# EAGLE design scoutshield_v1 (EAGLE 6.5.0)
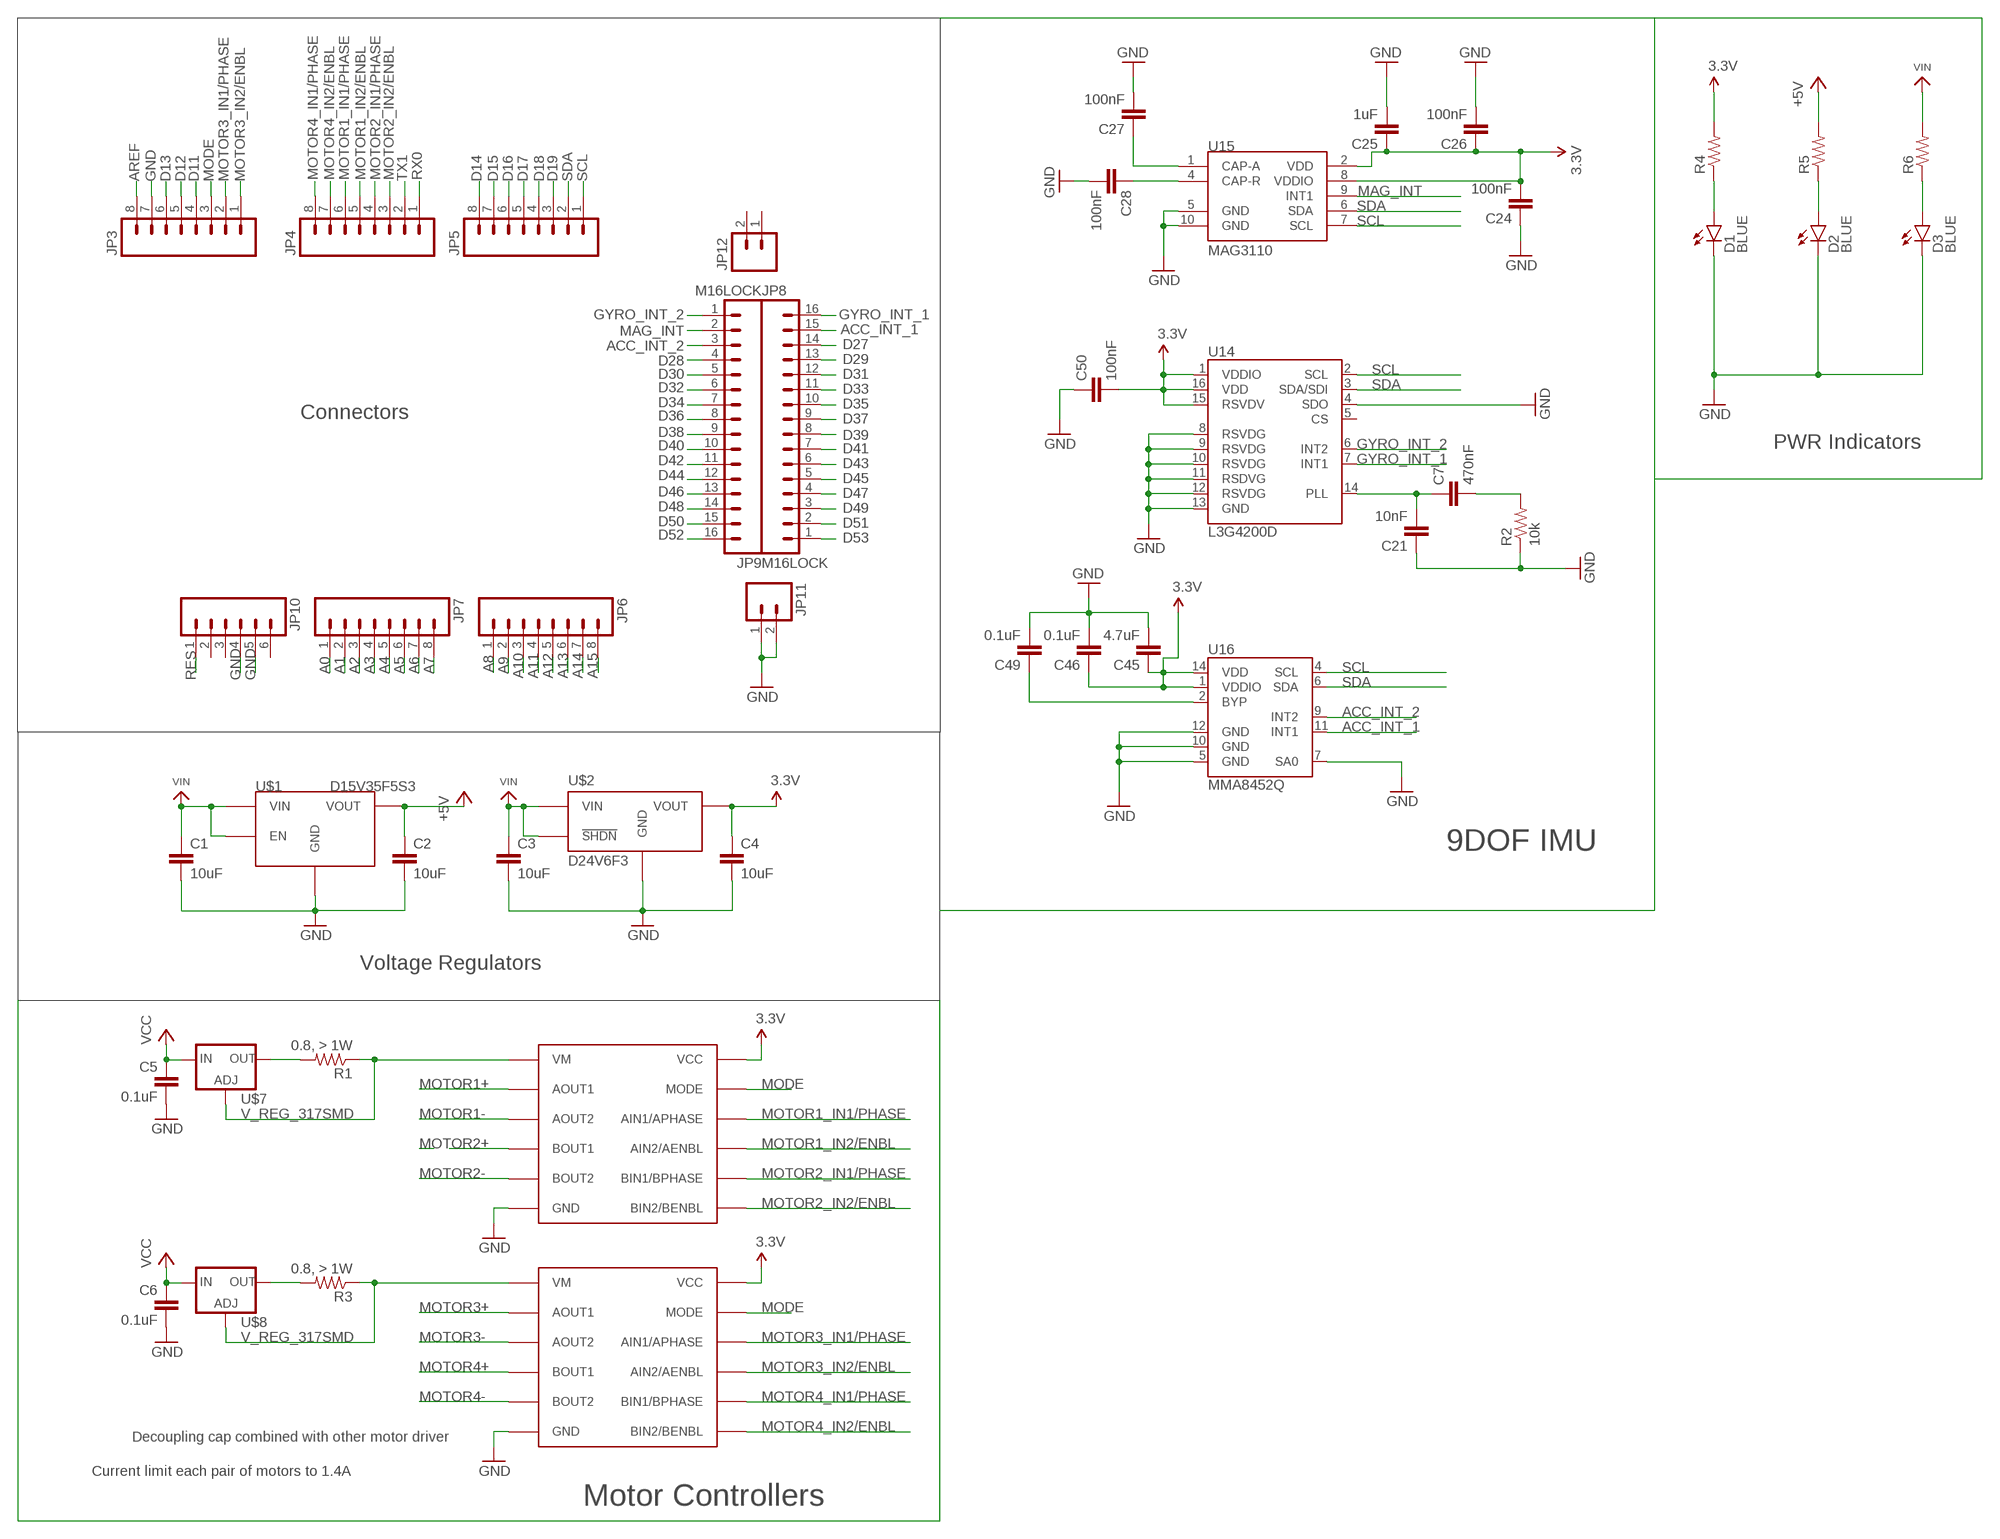
[diagram p0: schematic, sheet 1]

## Parts
C1  10uF  CAP1206  [1206]
C2  10uF  CAP1206  [1206]
C3  10uF  CAP1206  [1206]
C4  10uF  CAP1206  [1206]
C5  0.1uF  CAP0603-CAP  [0603-CAP]
C6  0.1uF  CAP0603-CAP  [0603-CAP]
C7  470nF  CAP0603-CAP  [0603-CAP]
C21  10nF  CAP0603-CAP  [0603-CAP]
C24  100nF  CAP0603-CAP  [0603-CAP]
C25  1uF  CAP0603-CAP  [0603-CAP]
C26  100nF  CAP0603-CAP  [0603-CAP]
C27  100nF  CAP0603-CAP  [0603-CAP]
C28  100nF  CAP0603-CAP  [0603-CAP]
C45  4.7uF  CAP0603-CAP  [0603-CAP]
C46  0.1uF  CAP0603-CAP  [0603-CAP]
C49  0.1uF  CAP0603-CAP  [0603-CAP]
C50  100nF  CAP0603-CAP  [0603-CAP]
D1  BLUE  LED-BLUE0603  [LED-0603]
D2  BLUE  LED-BLUE0603  [LED-0603]
D3  BLUE  LED-BLUE0603  [LED-0603]
JP3  M08LOCK  [1X08_LOCK]
JP4  M08LOCK  [1X08_LOCK]
JP5  M08LOCK  [1X08_LOCK]
JP6  M08LOCK  [1X08_LOCK]
JP7  M08LOCK  [1X08_LOCK]
JP8  M16LOCK  [1X16_LOCK]
JP9  M16LOCK  [1X16_LOCK]
JP10  M06LOCK  [1X06_LOCK]
JP11  M02LOCK  [1X02_LOCK]
JP12  M02LOCK  [1X02_LOCK]
R1  0.8, > 1W  R-US_R2512  [R2512]
R2  10k  R-US_R0603  [R0603]
R3  0.8, > 1W  R-US_R2512  [R2512]
R4  RESISTOR0603-RES  [0603-RES]
R5  RESISTOR0603-RES  [0603-RES]
R6  RESISTOR0603-RES  [0603-RES]
U14  L3G4200D  [LGA16-4X4]
U15  MAG3110  [DFN-10]
U16  MMA8452Q  [QFN-16_0.5MM]
U$1  D15V35F5S3  [D15V35F5S3]
U$2  D24V6F3  [D24V6F3]
U$5  DRV8835  [WSON-12]
U$6  DRV8835  [WSON-12]
U$7  V_REG_317SMD  [SOT223]
U$8  V_REG_317SMD  [SOT223]

## Nets
3.3V: C4.1 C24.2 C25.1 C26.1 C45.1 C46.1 C50.2 R4.2 U14.1(VDDIO) U14.15(RSVDV) U14.16(VDD) U15.2(VDD) U15.8(VDDIO) U16.1(VDDIO) U16.14(VDD) U$2.VOUT U$5.P12(VCC) U$6.P12(VCC)
+5V: C2.1 R5.2 U$1.VOUT
A0: JP7.1
A1: JP7.2
A2: JP7.3
A3: JP7.4
A4: JP7.5
A5: JP7.6
A6: JP7.7
A7: JP7.8
A8: JP6.1
A9: JP6.2
A10: JP6.3
A11: JP6.4
A12: JP6.5
A13: JP6.6
A14: JP6.7
A15: JP6.8
ACC_INT_1: JP8.15 U16.11(INT1)
ACC_INT_2: JP9.3 U16.9(INT2)
AREF: JP3.8
D11: JP3.4
D12: JP3.5
D13: JP3.6
D14: JP5.8
D15: JP5.7
D16: JP5.6
D17: JP5.5
D18: JP5.4
D19: JP5.3
D27: JP8.14
D28: JP9.4
D29: JP8.13
D30: JP9.5
D31: JP8.12
D32: JP9.6
D33: JP8.11
D34: JP9.7
D35: JP8.10
D36: JP9.8
D37: JP8.9
D38: JP9.9
D39: JP8.8
D40: JP9.10
D41: JP8.7
D42: JP9.11
D43: JP8.6
D44: JP9.12
D45: JP8.5
D46: JP9.13
D47: JP8.4
D48: JP9.14
D49: JP8.3
D50: JP9.15
D51: JP8.2
D52: JP9.16
D53: JP8.1
GND: C1.2 C2.2 C3.2 C4.2 C5.2 C6.2 C21.1 C24.1 C25.2 C26.2 C27.2 C28.2 C45.2 C46.2 C49.2 C50.1 D1.C D2.C D3.C JP3.7 JP10.4 JP10.5 JP11.1 JP11.2 R2.1 U14.4(SDO) U14.8(RSVDG) U14.9(RSVDG) U14.10(RSVDG) U14.11(RSDVG) U14.12(RSVDG) U14.13(GND) U15.5(GND) U15.10(GND) U16.5(GND) U16.7(SA0) U16.10(GND) U16.12(GND) U$1.GND1(GND) U$1.GND2(GND) U$2.GND U$5.P6(GND) U$5.THERM1(GND) U$5.THERM2(GND) U$5.THERM3(GND) U$5.THERM4(GND) U$5.THERMCENTER(GND) U$6.P6(GND) U$6.THERM1(GND) U$6.THERM2(GND) U$6.THERM3(GND) U$6.THERM4(GND) U$6.THERMCENTER(GND)
GYRO_INT_1: JP8.16 U14.7(INT1)
GYRO_INT_2: JP9.1 U14.6(INT2)
MAG_INT: JP9.2 U15.9(INT1)
MODE: JP3.3 U$5.P11(MODE) U$6.P11(MODE)
MOTOR1+: U$6.P2(AOUT1)
MOTOR1-: U$6.P3(AOUT2)
MOTOR1_IN1/PHASE: JP4.6 U$6.P10(AIN1/APHASE)
MOTOR1_IN2/ENBL: JP4.5 U$6.P9(AIN2/AENBL)
MOTOR2+: U$6.P4(BOUT1)
MOTOR2-: U$6.P5(BOUT2)
MOTOR2_IN1/PHASE: JP4.4 U$6.P8(BIN1/BPHASE)
MOTOR2_IN2/ENBL: JP4.3 U$6.P7(BIN2/BENBL)
MOTOR3+: U$5.P2(AOUT1)
MOTOR3-: U$5.P3(AOUT2)
MOTOR3_IN1/PHASE: JP3.2 U$5.P10(AIN1/APHASE)
MOTOR3_IN2/ENBL: JP3.1 U$5.P9(AIN2/AENBL)
MOTOR4+: U$5.P4(BOUT1)
MOTOR4-: U$5.P5(BOUT2)
MOTOR4_IN1/PHASE: JP4.8 U$5.P8(BIN1/BPHASE)
MOTOR4_IN2/ENBL: JP4.7 U$5.P7(BIN2/BENBL)
N$1: R1.1 U$6.P1(VM) U$7.1(ADJ)
N$2: R1.2 U$7.2(OUT)
N$4: R3.1 U$5.P1(VM) U$8.1(ADJ)
N$5: R3.2 U$8.2(OUT)
N$8: D1.A R4.1
N$9: D2.A R5.1
N$10: D3.A R6.1
N$38: C7.1 C21.2 U14.14(PLL)
N$39: C7.2 R2.2
N$50: C49.1 U16.2(BYP)
N$53: C27.1 U15.1(CAP-A)
N$54: C28.1 U15.4(CAP-R)
RES: JP10.1
RX0: JP4.1
SCL: JP5.1 U14.2(SCL) U15.7(SCL) U16.4(SCL)
SDA: JP5.2 U14.3(SDA/SDI) U15.6(SDA) U16.6(SDA)
TX1: JP4.2
VIN: C1.1 C3.1 C5.1 C6.1 R6.2 U$1.EN U$1.VIN U$2.!SHDN U$2.VIN U$7.3(IN) U$8.3(IN) ; supply symbol labelled VCC
Unconnected: JP10.2 JP10.3 JP10.6 JP12.1 JP12.2 U14.5(CS)

## Notes on the sheet
- Connectors
- PWR Indicators
- 9DOF IMU
- Voltage Regulators
- Decoupling cap combined with other motor driver
- Current limit each pair of motors to 1.4A
- Motor Controllers

## Library data of the parts
C1-C4 = SparkFun-Capacitors:CAP: Capacitor Standard 0603 ceramic capacitor, and 0.1" leaded capacitor.
C5-C7 C21 C24-C28 C45 C46 C49 C50 = SparkFun:CAP: Capacitor Standard 0603 ceramic capacitor, and 0.1" leaded capacitor.
D1-D3 = SparkFun-LED:LED-BLUE: Blue LEDs for production use Various blue LEDs stocked by SparkFun production 0603 - DIO-08575 Rebel - DIO-09553 1206 - DIO-09911; PROD_ID: DIO-08575
JP3-JP7 = SparkFun:M08: Header 8 Standard 8-pin 0.1" header. Use with straight break away headers (SKU : PRT-00116), right angle break away headers (PRT-00553), swiss pins (PRT-00743), machine pins (PRT-00117), and female headers (PRT-00115).
JP8 JP9 = SparkFun:M16
JP10 = SparkFun:M06: Header 6 Standard 6-pin 0.1" header. Use with straight break away headers (SKU : PRT-00116), right angle break away headers (PRT-00553), swiss pins (PRT-00743), machine pins (PRT-00117), and female headers (PRT-00115). Molex polarized connector foot print use with SKU : PRT-08094 with associated crimp pins and housings. NOTES ON THE VARIANTS LOCK and LOCK_LONGPADS... This footprint was designed to help hold the alignment of a through-hole component (i.e. 6-pin header) while soldering it into place. You may notice that each hole has been shifted either up or down by 0.005 of an inch from it's more standard position (which is a perfectly straight line). This slight alteration caused the pins (the squares in the middle) to touch the edges of the holes. Because they are alternating, it causes a "brace" to hold the component in place. 0.005 has proven to be the perfect amount of "off-center" position when using our standard breakaway headers. Although looks a little odd when you look at the bare footprint, once you have a header in there, the alteration is very hard to notice. Also, if you push a header all the way into place, it is covered up entirely on the bottom side. This idea of altering the position of holes to aid alignment will be further integrated into the Sparkfun Library for other footprints. It can help hold any component with 3 or more connection pins.
JP11 JP12 = SparkFun:M02: Header 2 Standard 2-pin 0.1" header. Use with straight break away headers (SKU : PRT-00116), right angle break away headers (PRT-00553), swiss pins (PRT-00743), machine pins (PRT-00117), and female headers (PRT-00115). Molex polarized connector foot print use with SKU : PRT-08233 with associated crimp pins and housings.
R1 R3 = rcl:R-US_: RESISTOR, American symbol
R2 = resistor:R-US_: RESISTOR, American symbol
R4-R6 = SparkFun-Resistors:RESISTOR: Resistor Basic schematic elements and footprints for 0603, 1206, and PTH resistors.
U14 = SparkFun-Sensors:L3G4200D: L3G4200D Three-axis, digital output gyroscope The L3G4200D is a low-power three-axis angular rate sensor, has a full scale of ±250/±500/±2000 dps and is capable of measuring rates with a user-selectable bandwidth. It includes a sensing element and an IC interface capable of providing the measured angular rate to the external world through a digital interface (I2C/SPI). Package: 4x4x1.1 LGA-16 (LGA16-4x4.PAC)
U15 = SparkFun-Sensors:MAG3110: 3-axis digital (I2C) magnetometer
U16 = SparkFun-Sensors:MMA8452Q: MMA8452Q 3-Axis, 12/8-bit Digital Accelerometer Supply Voltage: 1.6-3.6V Range: +/- 2g, 4g, 8g Interface: I2C, 12-bit and 8-bit ODR: 1.56 Hz - 800 Hz Package: QFN-16 http://cache.freescale.com/files/sensors/doc/data_sheet/MMA8452Q.pdf
U$1 = scout:D15V35F5S3
U$2 = scout:D24V6F3
U$5 U$6 = scout:DRV8835
U$7 U$8 = SparkFun:V_REG_317: Voltage Regulator Standard LM317 adjustable voltage regulator. AOI (Adjust Output Input). Google 'LM317 Calculator' for easy to use app to get the two resistor values needed. 240/720 for 5V output. 240/390 for 3.3V output. Spark Fun Electronics SKU : COM-00527

## Board
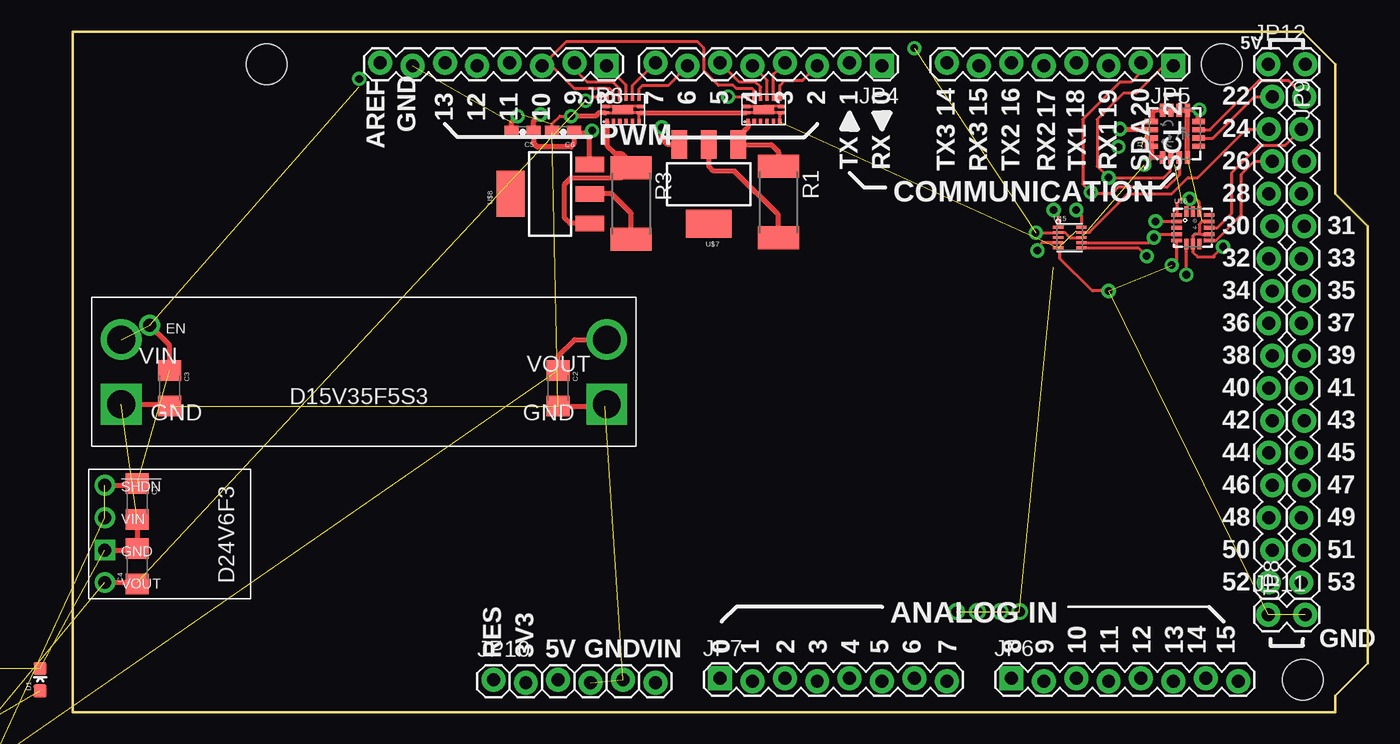
[diagram p1: board, top side]
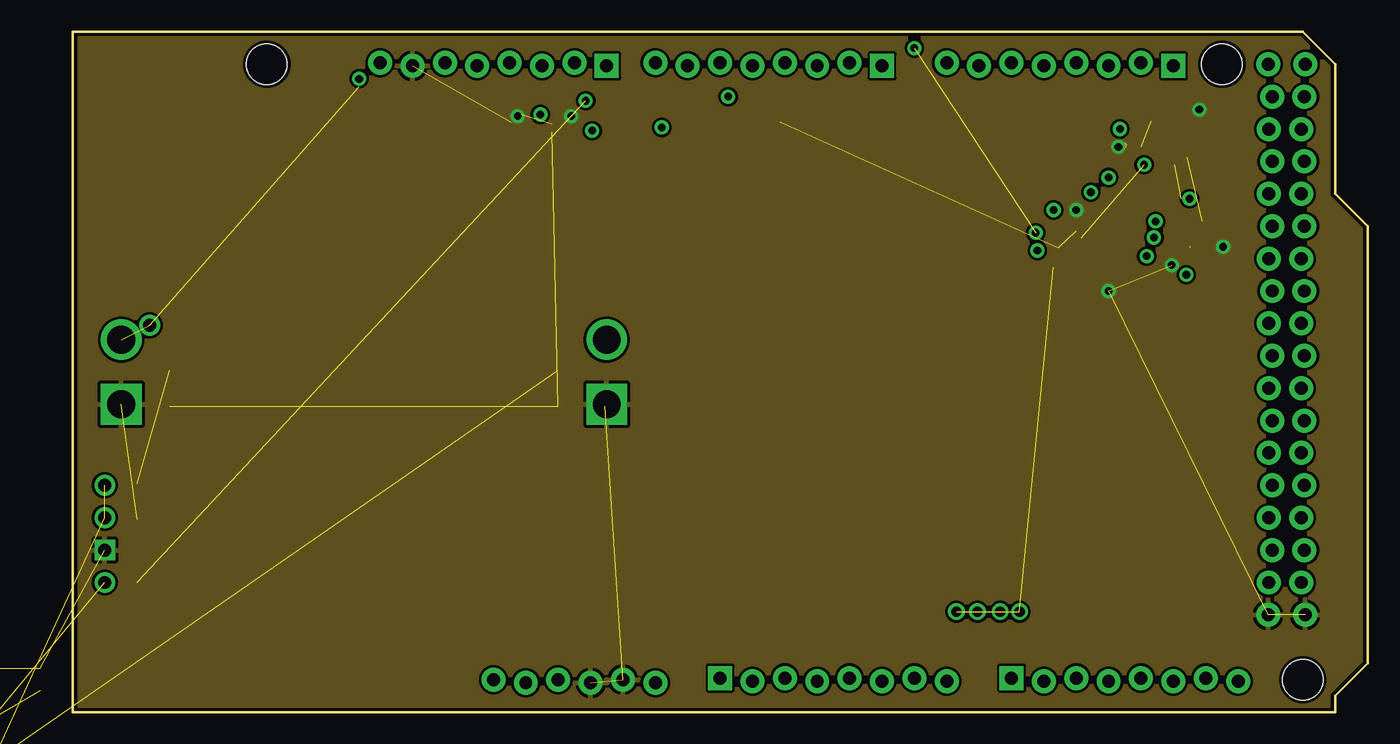
[diagram p2: board, inner layer GND]
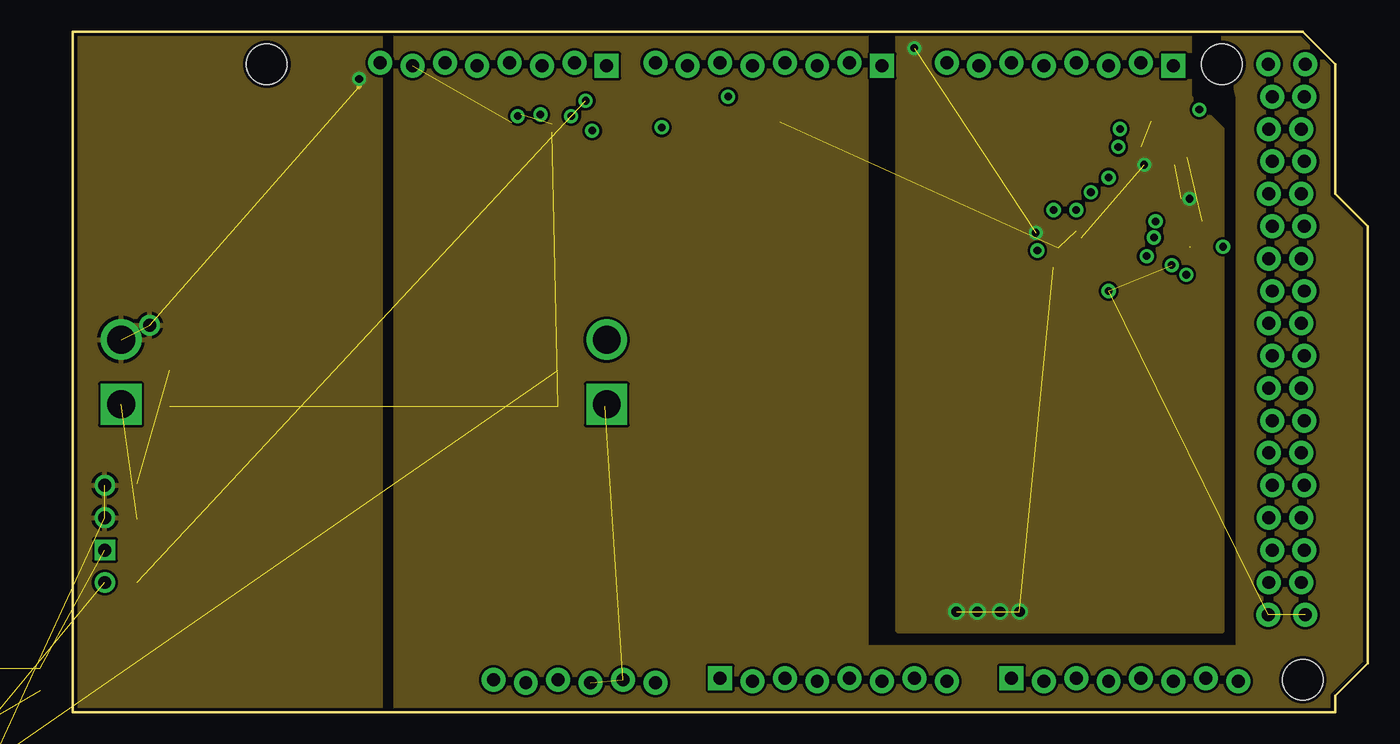
[diagram p3: board, inner layer VCC]
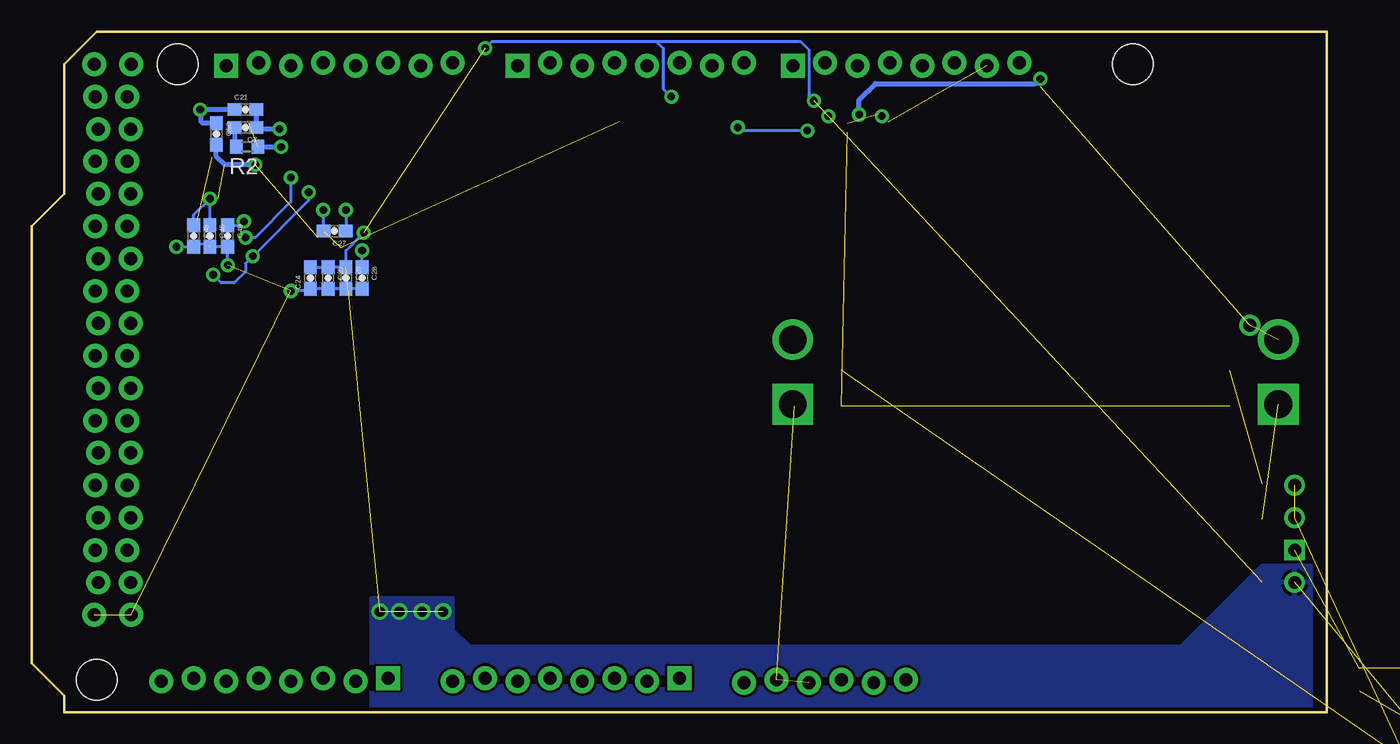
[diagram p4: board, bottom side, seen from below]

Size 101.6 x 53.34 mm. Coordinates in mm from the lower left corner, seen from the top.
Outline: 0,0 99.06,0 99.06,1.27 101.6,3.81 101.6,38.1 99.06,40.64 99.06,50.8 96.52,53.34 0,53.34 0,0
Copper layers (1*2*15*16): Top 0.035mm / dielectric 1.5mm / GND 0.035mm / dielectric 0.15mm / VCC 0.035mm / dielectric 0.2mm / Bottom 0.035mm
Design rules "SparkFun *": minimum track width 8mil, minimum drill 20mil, track to track 8mil, track to pad 8mil, pad to pad 8mil, via to via 8mil, smd to smd 8mil, copper to edge 10mil, drill to drill 8mil, minimum pad ring 12mil, minimum via ring 10mil, stop-mask expansion 4mil, vias tented up to drill 25mil, thermal gap 10mil
Holes 3.2 mm at 15.24,50.8 90.17,50.8 96.52,2.54

### Footprints (pad centres in the part's own frame; a part is rotated, then mirrored left to right if it is on the bottom)
1206 = smd 1.6 x 1.8: 1 -1.4,0; 2 1.4,0
0603-CAP = smd 1.1 x 1: 1 -0.85,0; 2 0.85,0
LED-0603 = smd 1 x 1: A 0,-0.877; C 0,0.877
1X08_LOCK = drill 1.016 pad 1.88 square: 1 0,0.127 | drill 1.016 pad 1.88: 2 2.54,-0.127; 3 5.08,0.127; 4 7.62,-0.127; 5 10.16,0.127; 6 12.7,-0.127; 7 15.24,0.127; 8 17.78,-0.127
1X16_LOCK = drill 1.016 pad 1.88: 1 0,0.127; 2 2.54,-0.127; 3 5.08,0.127; 4 7.62,-0.127; 5 10.16,0.127; 6 12.7,-0.127; 7 15.24,0.127; 8 17.78,-0.127; 9 20.32,0.127; 10 22.86,-0.127; 11 25.4,0.127; 12 27.94,-0.127; 13 30.48,0.127; 14 33.02,-0.127; 15 35.56,0.127; 16 38.1,-0.127
1X06_LOCK = drill 1.016 pad 1.88: 1 0,0; 2 2.54,-0.254; 3 5.08,0; 4 7.62,-0.254; 5 10.16,0; 6 12.7,-0.254
1X02_LOCK = drill 1.016 pad 1.88: 1 -0.178,0; 2 2.718,0
R2512 = smd 1.8 x 3.2: 1 -2.8,0; 2 2.8,0
R0603 = smd 1 x 1.1: 1 -0.85,0; 2 0.85,0
0603-RES = smd 1.1 x 1: 1 -0.85,0; 2 0.85,0
LGA16-4X4 = smd 1 x 0.4: 1 -1.85,0.975; 2 -1.85,0.325; 3 -1.85,-0.325; 4 -1.85,-0.975; 9 1.85,-0.975; 10 1.85,-0.325; 11 1.85,0.325; 12 1.85,0.975 | smd 0.4 x 1: 5 -0.975,-1.85; 6 -0.325,-1.85; 7 0.325,-1.85; 8 0.975,-1.85; 13 0.975,1.85; 14 0.325,1.85; 15 -0.325,1.85; 16 -0.975,1.85
DFN-10 = smd 0.8 x 0.22: 1 -0.91,0.8; 2 -0.91,0.4; 3 -0.91,0; 4 -0.91,-0.4; 5 -0.91,-0.8; 6 0.91,-0.8; 7 0.91,-0.4; 8 0.91,0; 9 0.91,0.4; 10 0.91,0.8
QFN-16_0.5MM = smd 0.8 x 0.3: 1 -1.275,1; 2 -1.275,0.5; 3 -1.275,0; 4 -1.275,-0.5; 5 -1.275,-1; 9 1.275,-1; 10 1.275,-0.5; 11 1.275,0; 12 1.275,0.5; 13 1.275,1 | smd 0.3 x 0.8: 6 -0.5,-1.275; 7 0,-1.275; 8 0.5,-1.275; 14 0.5,1.275; 15 0,1.275; 16 -0.5,1.275
D15V35F5S3 = drill 1.016 pad 1.524: EN 16.815,-3.658 | drill 2.184 square: GND1 -19.05,2.54; GND2 19.05,2.54 | drill 2.184 pad 2.692: VIN 19.05,-2.54; VOUT -19.05,-2.54
D24V6F3 = drill 1.016: !SHDN -3.81,-5.08; VIN -1.27,-5.08; VOUT 3.81,-5.08 | drill 1.016 square: GND 1.27,-5.08
WSON-12 = smd 0.25 x 0.5: P1 -1.25,-0.95; P2 -0.75,-0.95; P3 -0.25,-0.95; P4 0.25,-0.95; P5 0.75,-0.95; P6 1.25,-0.95; P7 1.25,0.95; P8 0.75,0.95; P9 0.25,0.95; P10 -0.25,0.95; P11 -0.75,0.95; P12 -1.25,0.95 | smd 0.6 x 0.25: THERM1 -1.4,-0.25; THERM2 1.4,-0.25; THERM3 1.4,0.25; THERM4 -1.4,0.25 | smd 1.6 x 0.7: THERMCENTER 0,0
SOT223 = smd 1.219 x 2.235: 1 -2.311,-3.099; 2 0,-3.099; 3 2.311,-3.099 | smd 3.6 x 2.2: 4 0,3.099

### Placement (x,y rotation side)
C1  5.08,16.51 270 top
C2  38.1,25.4 270 top
C3  7.62,25.4 270 top
C4  5.08,11.43 90 top
C5  35.31,45.47 180 top
C6  38.48,45.47 180 top
C7  84.84,45.85 180 bottom
C21  84.84,47.24 0 bottom
C24  79.76,34.04 90 bottom
C25  78.36,34.04 270 bottom
C26  76.96,34.04 270 bottom
C27  77.85,37.72 180 bottom
C28  75.69,34.04 270 bottom
C45  88.9,37.34 270 bottom
C46  87.63,37.34 270 bottom
C49  86.23,37.34 270 bottom
C50  87.12,45.34 270 bottom
D1  -2.54,2.54 0 top
D2  -6.35,2.54 0 top  (outside the outline)
D3  -10.16,2.54 0 top  (outside the outline)
JP3  41.91,50.8 180 top
JP4  63.5,50.8 180 top
JP5  86.36,50.8 180 top
JP6  73.66,2.54 0 top
JP7  50.8,2.54 0 top
JP8  96.52,10.16 90 top
JP9  93.98,48.26 270 top
JP10  33.02,2.54 0 top
JP11  93.98,7.62 0 top
JP12  93.98,50.8 0 top
R1  55.37,40.01 270 top
R2  84.71,44.32 180 bottom
R3  43.81,39.88 270 top
R4  -8.89,-2.54 0 top  (outside the outline)
R5  -8.89,-5.08 0 top  (outside the outline)
R6  -8.89,-7.62 0 top  (outside the outline)
U14  86.49,45.34 90 top
U15  78.23,37.21 0 top
U16  87.88,37.97 0 top
U$1  22.86,26.67 180 top
U$2  7.62,13.97 270 top
U$5  43.18,47.24 0 top
U$6  54.23,47.24 0 top
U$7  49.91,41.4 180 top
U$8  37.47,40.64 90 top

### Tracks (layer width: path | path; a pad name or v marks a point on that pad's centre or on a via)
3.3V  (via drill 0.6, 0.8)  (9 unrouted)
  Top 0.254: v51.44,48.26 52.91,48.26 U$6.P12 | U16.1 86.61,39.88 87,40.26 v87.63,40.26 88.14,40.26 88.38,40.01 U16.14 | v75.56,37.59 77.3,37.59 U15.2 77.83,37.61 78.23,37.21 U15.8 | U$5.P12 40.51,48.19 v40.26,47.94
  Top 0.406: U$2.VOUT 5.08,10.16 C4.1 | U14.15 U14.16 84.64,43.49 | 84.64,43.49 v84.07,42.93 | 84.64,43.49 U14.1
  Bottom 0.254: 52.58,52.58 41.27,52.58 40.64,51.94 40.64,48.32 v40.26,47.94 | 52.58,52.58 65.53,52.58 v66.04,52.07 | 52.58,52.58 52.07,52.07 52.07,48.9 v51.44,48.26 | C46.1 v87.63,40.26 88.9,38.99 C45.1 | v75.56,37.59 76.96,36.2 C26.1 C25.1 C24.2
  Bottom 0.406: v84.07,42.93 86.49,42.93 87.12,43.56 C50.2
  other vias: 69.34,7.87 70.99,7.87 72.77,7.87 74.3,7.87
  pour VCC: 66.04,53.34 87.63,53.34 87.63,48.26 90.17,45.72 90.17,6.35 64.77,6.35 64.77,53.34
  pour Bottom: 1.27,11.43 5.08,11.43 11.43,5.08 67.31,5.08 68.58,6.35 68.58,8.89 74.93,8.89 74.93,0 1.27,0
5V
  pour VCC: 90.17,53.34 96.52,53.34 99.06,50.8 99.06,40.64 101.6,38.1 101.6,3.81 99.06,1.27 99.06,0 36.83,0 25.4,0 25.4,53.34 62.23,53.34 62.23,5.08 91.44,5.08 91.44,48.26
+5V  (1 unrouted)
  Top 0.406: C2.1 38.1,27.94 39.37,29.21 U$1.VOUT
A0
  Top 0.203: JP7.1 50.8,2.54
A1
  Top 0.203: JP7.2 53.34,2.54 JP7.2
A2
  Top 0.203: JP7.3 55.88,2.54
A3
  Top 0.203: JP7.4 58.42,2.54 JP7.4
A4
  Top 0.203: JP7.5 60.96,2.54
A5
  Top 0.203: JP7.6 63.5,2.54 JP7.6
A6
  Top 0.203: JP7.7 66.04,2.54
A7
  Top 0.203: JP7.8 68.58,2.54 JP7.8
A8
  Top 0.203: JP6.1 73.66,2.54
A9
  Top 0.203: JP6.2 76.2,2.54 JP6.2
A10
  Top 0.203: JP6.3 78.74,2.54
A11
  Top 0.203: JP6.4 81.28,2.54 JP6.4
A12
  Top 0.203: JP6.5 83.82,2.54
A13
  Top 0.203: JP6.6 86.36,2.54 JP6.6
A14
  Top 0.203: JP6.7 88.9,2.54
A15
  Top 0.203: JP6.8 91.44,2.54 JP6.8
ACC_INT_1
  Top 0.254: U16.11 89.79,37.97 90.93,39.12 90.93,42.29 93.09,44.45 95.12,44.45 JP8.15
ACC_INT_2
  Top 0.254: U16.9 89.68,36.97 91.69,38.99 91.69,42.16 92.71,43.18 JP9.3
AREF
  Top 0.203: JP3.8 24.13,50.8 JP3.8
D11
  Top 0.203: JP3.4 34.29,50.8 JP3.4
D12
  Top 0.203: JP3.5 31.75,50.8
GND  (via drill 0.6)  (18 unrouted)
  Top 0.254: U$5.THERM2 44.43,46.99 | 43.18,46.99 U$5.THERM1 | U$5.THERM2 43.18,46.99 | 43.18,46.99 U$5.THERMCENTER | U$5.THERM2 | U$6.THERM1 54.23,46.99 | 54.23,46.99 U$6.THERM2 55.48,46.84 U$6.P6 | 54.23,46.99 U$6.THERMCENTER 54.23,47.49 | U$5.P6 44.43,46.84 U$5.THERM2 | U$6.THERM3 54.23,47.49 | U$6.THERM4 54.23,47.49 | U$5.THERM4 43.18,47.49 | U$5.THERMCENTER 43.18,46.99 | U$5.THERM3 43.18,47.49 | 43.18,47.49 U$5.THERMCENTER | U16.10 88.52,37.47 | U16.12 88.64,38.47 88.39,38.23 88.39,37.59 88.52,37.47 | v90.26,36.49 89.53,35.77 89.53,35.69 88.27,35.69 87.88,36.07 U16.7 87.88,37.34 88.01,37.47 88.52,37.47 | U16.5 86.61,35.43 v86.23,35.05 | v78.74,39.37 79.14,38.97 U15.10 | v81.28,33.02 80.01,33.02 77.47,35.56 77.47,36.26 U15.5 | C6.2 37.63,46.14 38.23,46.74 v39.12,46.74
  Top 0.406: U$2.GND 5.08,12.7 C4.2 C1.2 | U$1.GND2 7.62,24.13 C3.2 | C2.2 41.78,24 U$1.GND1 | U14.9 U14.10 U14.11 U14.12 84.91,47.19 84.71,46.99 84.71,46.39 U14.13 | U14.9 v88.39,47.24 88.34,47.19 U14.8 | U14.4 U14.9 | U$5.THERM1 41.28,46.99 41.02,46.74 v39.12,46.74 | U$5.THERM2 U$6.THERM1 | C5.2 34.46,46.27 v34.92,46.74
  GND 0.406: v82.04,44.32 82.42,44.32 82.55,44.45 | v39.12,46.74 39.37,46.99 38.86,46.99 38.73,46.86 | v34.92,46.74 35.05,46.74 35.18,46.86
  Bottom 0.254: 90.3,36.45 v90.26,36.49 C45.2 88.69,36.7 U16.7 87.67,36.49 C49.2 v86.23,35.05 | C27.2 78.7,39.33 v78.74,39.37 | C28.2 C26.2 C25.2 C24.1 79.92,33.02 v81.28,33.02
  Bottom 0.406: C21.1 v88.39,47.24 88.34,47.19 U14.8 88.21,46.19 C50.1 | R2.1 v82.04,44.32
  pour GND: 0,53.34 96.52,53.34 99.06,50.8 99.06,40.64 101.6,38.1 101.6,3.81 99.06,1.27 99.06,0 0,0
GYRO_INT_1
  Top 0.254: U14.7 89.22,45.66 93.09,49.53 95.38,49.53 JP8.16
GYRO_INT_2
  Top 0.254: U14.6 89.46,45.01 92.71,48.26 JP9.1
MAG_INT
  Top 0.254: U15.9 79.78,37.61 82.8,40.64 86.23,40.64 87.5,41.91 88.27,41.91 92.08,45.72 JP9.2
MODE
  Top 0.254: U$5.P11 42.42,48.21 42.42,48.64 42.16,48.9 39.37,48.9 37.59,50.67 JP3.3 38.73,52.58 49.02,52.58 49.53,52.07 49.53,50.29 50.67,49.15 51.82,49.15 52.07,48.9 53.34,48.9 53.48,48.76 U$6.P11
MOTOR1_IN1/PHASE
  Top 0.203: JP4.6 50.8,50.8
  Top 0.254: U$6.P10 53.98,49.02 53.59,49.4 52.32,49.4 JP4.6
MOTOR1_IN2/ENBL
  Top 0.203: JP4.5 53.34,50.8
  Top 0.254: U$6.P9 54.48,49.53 JP4.5
MOTOR2_IN1/PHASE
  Top 0.203: JP4.4 55.88,50.8
  Top 0.254: U$6.P8 54.98,50.03 JP4.4
MOTOR2_IN2/ENBL
  Top 0.203: JP4.3 58.42,50.8
  Top 0.254: U$6.P7 55.48,49.13 55.88,49.53 57.28,49.53 JP4.3
MOTOR3_IN1/PHASE
  Top 0.203: JP3.2 39.37,50.8
  Top 0.254: U$5.P10 42.93,48.89 42.42,49.4 40.39,49.4 39.37,50.42 JP3.2
MOTOR3_IN2/ENBL
  Top 0.203: JP3.1 41.91,50.8
  Top 0.254: U$5.P9 43.43,49.15 JP3.1
MOTOR4_IN1/PHASE
  Top 0.203: JP4.8 45.72,50.8
  Top 0.254: U$5.P8 43.93,49.14 JP4.8
MOTOR4_IN2/ENBL
  Top 0.203: JP4.7 48.26,50.8
  Top 0.254: U$5.P7 44.43,48.88 44.7,49.15 46.74,49.15 JP4.7
N$1
  Top 0.406: U$6.P1 52.98,45.87 52.2,45.09 52.2,44.53 U$7.1 54.81,44.5 55.37,43.94 R1.1
N$2
  Top 0.406: R1.2 55.37,38.99 51.94,42.42 50.29,42.42 49.91,42.8 U$7.2
N$4
  Top 0.406: U$5.P1 41.93,44.47 41.91,44.45 42.55,43.81 43.05,43.81 43.81,43.05 R3.1 43.05,41.91 39.12,41.91 38.61,41.4 38.61,38.73 39.01,38.33 U$8.1
N$5
  Top 0.406: R3.2 43.81,39.12 42.29,40.64 U$8.2
N$8  (1 unrouted)
N$9  (1 unrouted)
N$10  (1 unrouted)
N$38  (via drill 0.6)
  Top 0.406: U14.14 82.22,45.66 v82.17,45.72
  Bottom 0.406: C21.2 C7.1 83.86,45.72 v82.17,45.72
N$39
  Bottom 0.406: C7.2 85.69,44.45 R2.2
N$50  (via drill 0.6)
  Top 0.254: v84.96,38.48 86.6,38.48 U16.2
  Bottom 0.254: C49.1 85.26,38.19 v84.96,38.48
N$53  (via drill 0.6)
  Top 0.254: U15.1 77.32,39.01 v76.96,39.37
  Bottom 0.254: v76.96,39.37 76.96,37.76 C27.1
N$54  (via drill 0.6)
  Top 0.254: v75.69,36.2 75.69,36.45 76.07,36.83 77.3,36.83 U15.4
  Bottom 0.254: C28.1 v75.69,36.2
RX0
  Top 0.203: JP4.1 63.5,50.8
SCL  (via drill 0.6)
  Top 0.254: JP5.1 86.36,50.8 85.72,50.8 83.44,48.51 82.42,48.51 80.39,46.48 80.39,42.8 v81.28,41.91 85.6,41.91 86.11,42.42 86.11,43.43 U14.2 | U16.4 85.1,37.47 v84.84,37.21 84.44,36.81 U15.7
  Bottom 0.254: v81.28,41.91 81.28,40.01 84.07,37.21 v84.84,37.21
SDA  (via drill 0.6)
  Top 0.254: JP5.2 83.82,50.16 83.06,49.4 82.17,49.4 79.25,46.48 79.25,41.4 v79.88,40.77 80.01,40.64 81.53,40.64 82.04,41.15 85.85,41.15 86.81,42.11 U14.3 | v87.38,34.29 U16.6 | U15.6 83.6,36.41 v84.26,35.75
  Bottom 0.254: v79.88,40.77 79.88,40.13 84.14,35.88 v84.26,35.75 84.84,35.18 84.84,34.54 85.72,33.66 86.74,33.66 v87.38,34.29
TX1
  Top 0.203: JP4.2 60.96,50.8 JP4.2
VIN  (via drill 0.6)  (5 unrouted)
  Top 0.254: 47.32,44.5 U$7.3
  Top 0.406: U$2.!SHDN 5.08,17.78 C1.1 | C3.1 7.62,28.75 U$1.EN | U$8.3 40.56,45.39 | 40.56,45.39 v40.77,45.59 | v36.7,46.86 36.16,46.32 C5.1 36.2,45.43 36.2,44.58 36.45,44.32 39.12,44.32 39.33,44.54 C6.1 39.41,45.39 40.56,45.39 | 47.32,44.5 46.69,44.5 46.23,44.96 v46.23,45.85
  VCC 0.406: 22.35,49.91 22.48,49.78 v22.48,49.66 22.48,49.02
  Bottom 0.254: v40.77,45.59 45.97,45.59 v46.23,45.85
  Bottom 0.406: v36.7,46.86 36.7,48.01 35.43,49.28 22.86,49.28 v22.48,49.66
  pour VCC: 0,53.34 24.13,53.34 24.13,0 0,0

### Text on the board
tPlace: 5V | 9 | 8 | 7 | 6 | 5 | 4 | 3 | 2 | 1 | 0 | 22 | 14 | 15 | 16 | 17 | 18 | 19 | 20 | 21 | 13 | 12 | 11 | 10 | GND | 24 | AREF | PWM | TX | RX | RX1 | 26 | TX3 | RX3 | TX2 | RX2 | TX1 | SDA | SCL | COMMUNICATION | 28 | 30 | 31 | 32 | 33 | 34 | 35 | 36 | 37 | 38 | 39 | 40 | 41 | 42 | 43 | 44 | 45 | 46 | 47 | 48 | 49 | 50 | 51 | 52 | 53 | ANALOG IN | 0 | 1 | 2 | 3 | 4 | 5 | 6 | 7 | 8 | 9 | 10 | 11 | 12 | 13 | 14 | 15 | GND | RES | 3V3 | 5V | GND | VIN